# Altium schematic sheet Sensors Interface.SchDoc
size A4
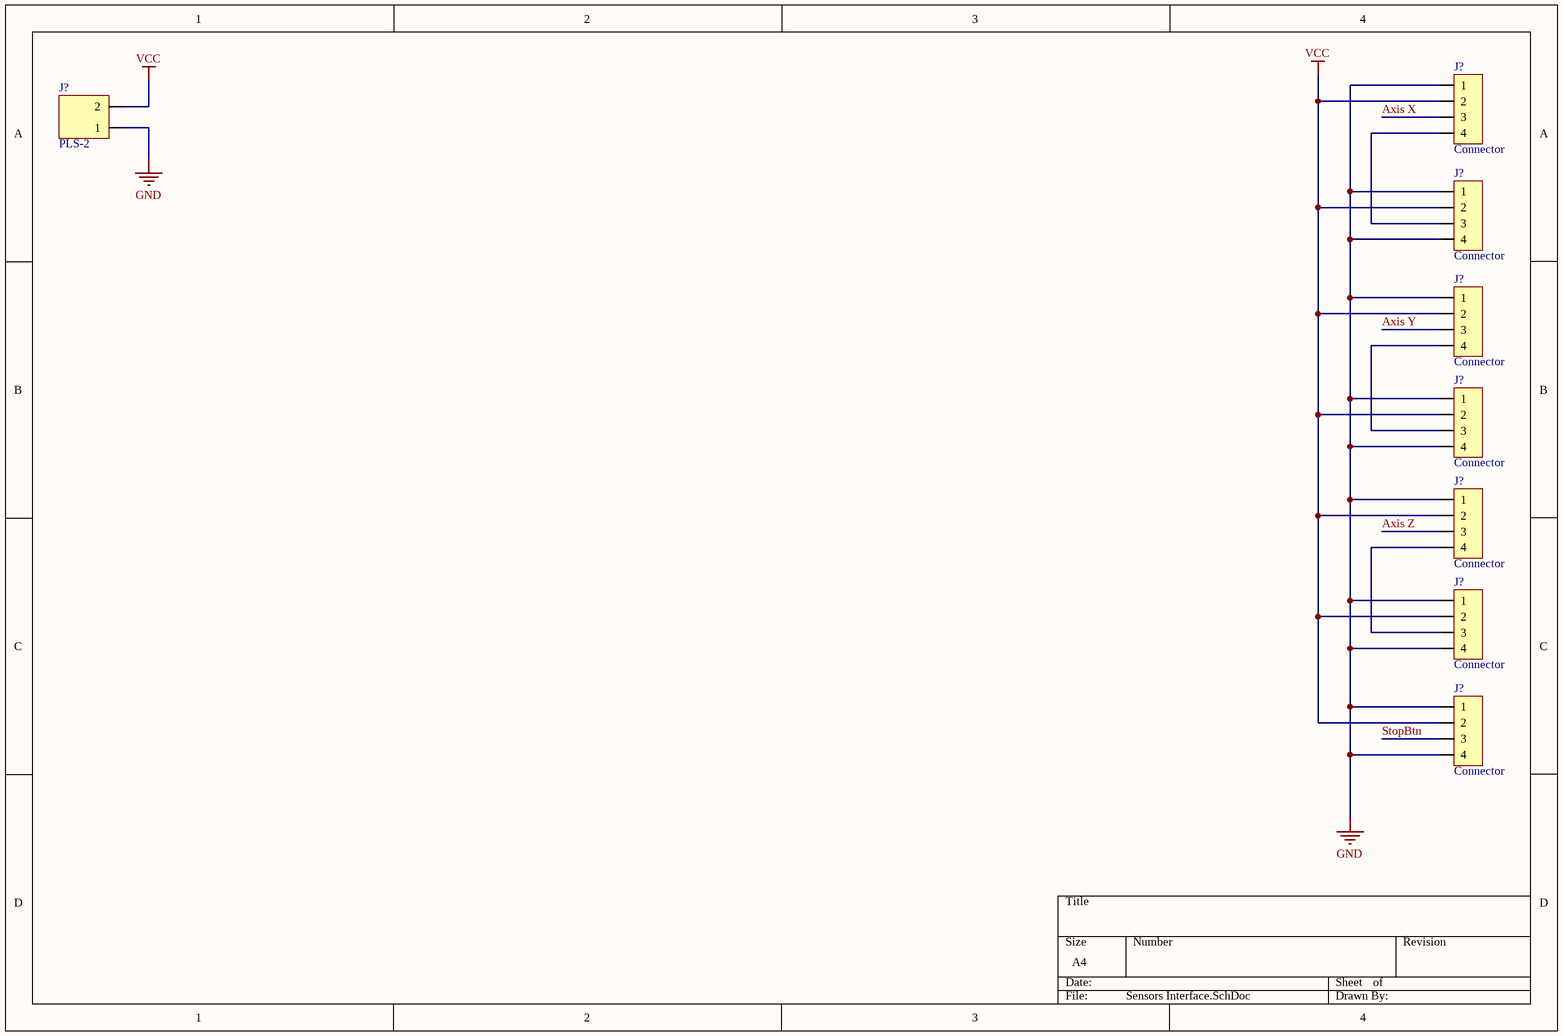
[diagram p0: Sensors Interface.SchDoc]

## Parts
(Parts that share a designator on the sheet are numbered #1, #2 ... from top to bottom, then left to right.)
J?#1  Connector  [Molex Micro-Fit 3.0 - 4 pin D R]
J?#2  PLS-2  [Line 2.54 x 2]
J?#3  Connector  [Molex Micro-Fit 3.0 - 4 pin D R]
J?#4  Connector  [Molex Micro-Fit 3.0 - 4 pin D R]
J?#5  Connector  [Molex Micro-Fit 3.0 - 4 pin D R]
J?#6  Connector  [Molex Micro-Fit 3.0 - 4 pin D R]
J?#7  Connector  [Molex Micro-Fit 3.0 - 4 pin D R]
J?#8  Connector  [Molex Micro-Fit 3.0 - 4 pin D R]

## Nets
GND: J?#1.1 J?#2.1 J?#3.1 J?#3.4 J?#4.1 J?#5.1 J?#5.4 J?#6.1 J?#7.1 J?#7.4 J?#8.1 J?#8.4
VCC: J?#1.2 J?#2.2 J?#3.2 J?#4.2 J?#5.2 J?#6.2 J?#7.2 J?#8.2
Axis X: J?#1.3
Axis Y: J?#4.3
Axis Z: J?#6.3
StopBtn: J?#8.3
NetJ?#1_4: J?#1.4 J?#3.3
NetJ?#4_4: J?#4.4 J?#5.3
NetJ?#6_4: J?#6.4 J?#7.3

## Library data of the parts
J?#1 J?#3-J?#8 = Micro-Fit 4R (2x2): Horisontal, Dbl line, Male - 3mm; Part Number: 0430450402; Name: Micro-Fit 3.0; URL: http://www.molex.com/molex/products/datasheet.jsp?part=active/0430450402_PCB_HEADERS.xml
J?#2 = PLS-2: Vert, Sgl line, Male